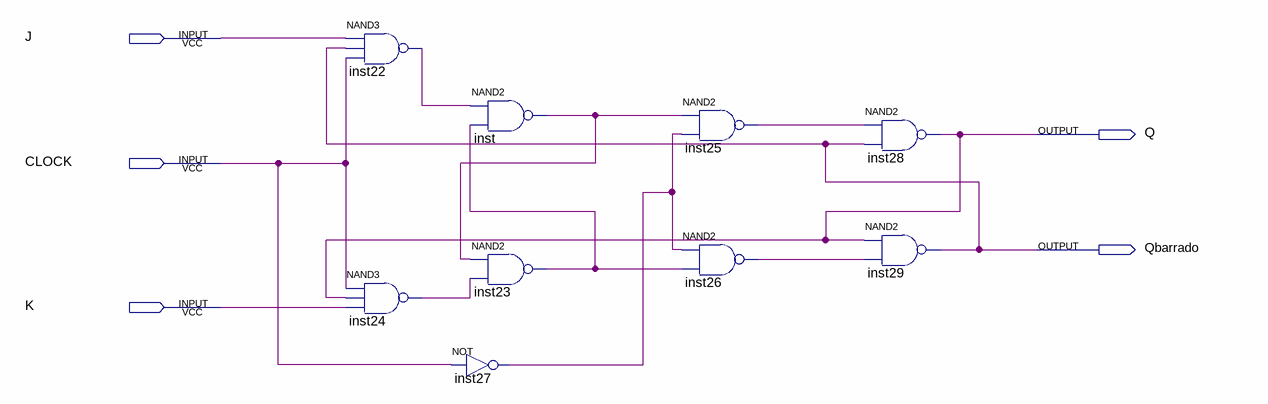
[diagram p0: schematic sheet]
// Quartus schematic relatorio1.bdf as structural Verilog: 9 symbols, 5 pins
module relatorio1 (
  input  J,
  input  CLOCK,
  input  K,
  output Q,
  output Qbarrado
);

  wire inst22_out, inst23_out, inst24_out, inst25_out, inst26_out, inst27_out, inst_out;

  nand inst22 (inst22_out, J, Qbarrado, CLOCK);
  nand inst24 (inst24_out, CLOCK, Q, K);
  not inst27 (inst27_out, CLOCK);
  nand inst (inst_out, inst22_out, inst23_out);
  nand inst23 (inst23_out, inst_out, inst24_out);
  nand inst25 (inst25_out, inst_out, inst27_out);
  nand inst26 (inst26_out, inst27_out, inst23_out);
  nand inst28 (Q, inst25_out, Qbarrado);
  nand inst29 (Qbarrado, Q, inst26_out);
endmodule
